# EAGLE design track-hold-sampler (EAGLE 9.5.0)
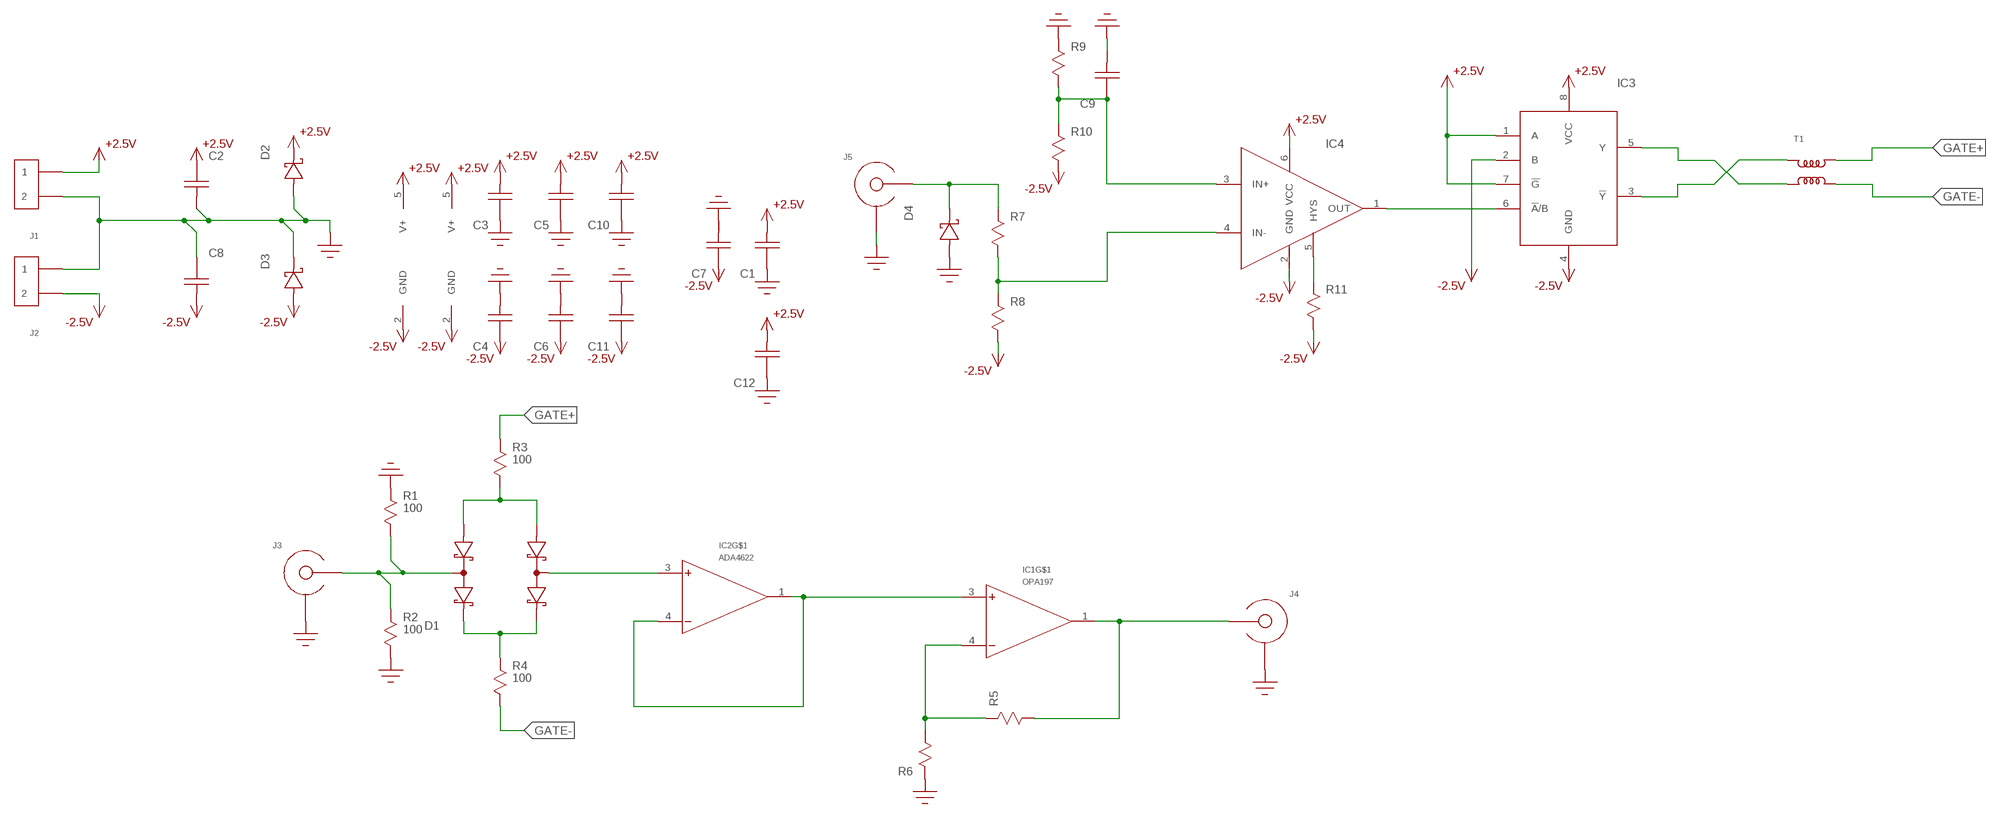
[diagram p0: schematic, sheet 1]

## Parts
C1  C0603  [C0603]
C2  C1206  [1206]
C3  C  [C0402]
C4  C  [C0402]
C5  C  [C0402]
C6  C  [C0402]
C7  C0603  [C0603]
C8  C1206  [1206]
C9  C  [C0402]
C10  C  [C0402]
C11  C  [C0402]
C12  C0603  [C0603]
D1  SMS3923-081  [SC-88]
D2  SCHOTTKYSOT-23  [SOT-23]
D3  SCHOTTKYSOT-23  [SOT-23]
D4  SCHOTTKYSOT-23  [SOT-23]
IC1  OPA197  OPA197TSOT  [TSOT-23]
IC2  ADA4622  [SOT23-5]
IC3  74LVC2G157  [SSOP8]
IC4  ADCMP601  [SC70-6]
J1  HEADER_2PIN  [HEADER_2PIN]
J2  HEADER_2PIN  [HEADER_2PIN]
J3  SMA-EDGE-LAUNCH4020N5  [SMA_EDGE_LAUNCH_4L_4020_N5]
J4  SMA-EDGE-LAUNCH4020N5  [SMA_EDGE_LAUNCH_4L_4020_N5]
J5  SMA-EDGE-LAUNCH4020N5  [SMA_EDGE_LAUNCH_4L_4020_N5]
R1  100  R0402  [0402]
R2  100  R0402  [0402]
R3  100  R0402  [0402]
R4  100  R0402  [0402]
R5  R0603  [R0603]
R6  R0603  [R0603]
R7  R0603  [R0603]
R8  R0603  [R0603]
R9  R0603  [R0603]
R10  R0603  [R0603]
R11  R0603  [R0603]
T1  MABA007159  [MABAES0061]

## Nets
+2.5V: C1.P$1 C2.P$2 C3.1 C5.1 C10.1 C12.P$1 D2.3(CATHODE) IC1.5(V+) IC2.5(V+) IC3.1(A) IC3.7(!G!) IC3.8(VCC) IC4.6(VCC) J1.1
-2.5V: C4.2 C6.2 C7.P$2 C8.P$1 C11.2 D3.1(ANODE) IC1.2(GND) IC2.2(GND) IC3.2(B) IC3.4(GND) IC4.2(GND) J2.2 R8.P$2 R10.P$2 R11.P$2
GATE+: R3.1 T1.1
GATE-: R4.2 T1.3
GND: C1.P$2 C2.P$1 C3.2 C4.1 C5.2 C6.1 C7.P$1 C8.P$2 C9.1 C10.2 C11.1 C12.P$2 D2.1(ANODE) D3.3(CATHODE) D4.1(ANODE) J1.2 J2.1 J3.BOTTOM_GND(SHIELD) J3.GND@1(SHIELD) J3.GND@2(SHIELD) J3.GND@3(SHIELD) J3.GND@4(SHIELD) J3.GND@5(SHIELD) J3.GND@6(SHIELD) J3.GND@7(SHIELD) J3.GND@8(SHIELD) J3.GND@9(SHIELD) J3.GND@10(SHIELD) J3.GND@14(SHIELD) J3.GND@15(SHIELD) J3.GND@16(SHIELD) J3.GND@17(SHIELD) J3.GND_PAD1(SHIELD) J3.GND_PAD2(SHIELD) J3.P$1(SHIELD) J3.P$2(SHIELD) J3.P$3(SHIELD) J3.P$4(SHIELD) J3.P$5(SHIELD) J4.BOTTOM_GND(SHIELD) J4.GND@1(SHIELD) J4.GND@2(SHIELD) J4.GND@3(SHIELD) J4.GND@4(SHIELD) J4.GND@5(SHIELD) J4.GND@6(SHIELD) J4.GND@7(SHIELD) J4.GND@8(SHIELD) J4.GND@9(SHIELD) J4.GND@10(SHIELD) J4.GND@14(SHIELD) J4.GND@15(SHIELD) J4.GND@16(SHIELD) J4.GND@17(SHIELD) J4.GND_PAD1(SHIELD) J4.GND_PAD2(SHIELD) J4.P$1(SHIELD) J4.P$2(SHIELD) J4.P$3(SHIELD) J4.P$4(SHIELD) J4.P$5(SHIELD) J5.BOTTOM_GND(SHIELD) J5.GND@1(SHIELD) J5.GND@2(SHIELD) J5.GND@3(SHIELD) J5.GND@4(SHIELD) J5.GND@5(SHIELD) J5.GND@6(SHIELD) J5.GND@7(SHIELD) J5.GND@8(SHIELD) J5.GND@9(SHIELD) J5.GND@10(SHIELD) J5.GND@14(SHIELD) J5.GND@15(SHIELD) J5.GND@16(SHIELD) J5.GND@17(SHIELD) J5.GND_PAD1(SHIELD) J5.GND_PAD2(SHIELD) J5.P$1(SHIELD) J5.P$2(SHIELD) J5.P$3(SHIELD) J5.P$4(SHIELD) J5.P$5(SHIELD) R1.1 R2.2 R6.P$1 R9.P$1
N$1: D1.2(COMMON0) J3.CENTER@1(CENTER) J3.CENTER@2(CENTER) R1.2 R2.1
N$2: D1.1(ANODE0) D1.6(ANODE1) R3.2
N$3: IC1.3(+) IC2.1(OUT) IC2.4(-)
N$4: IC1.4(-) R5.P$1 R6.P$2
N$5: IC1.1(OUT) J4.CENTER@1(CENTER) J4.CENTER@2(CENTER) R5.P$2
N$6: D1.5(COMMON1) IC2.3(+)
N$7: D1.3(CATHODE0) D1.4(CATHODE1) R4.1
N$8: IC3.6(!A!/B) IC4.1(OUT)
N$9: D4.3(CATHODE) J5.CENTER@1(CENTER) J5.CENTER@2(CENTER) R7.P$1
N$10: IC4.4(IN-) R7.P$2 R8.P$1
N$11: IC4.5(HYS) R11.P$1
N$12: C9.2 IC4.3(IN+) R9.P$2 R10.P$1
N$13: IC3.5(Y) T1.4
N$14: IC3.3(!Y!) T1.5

## Library data of the parts
C1-C12 = yapo:C
D1 = yapo:SMS3923-081
D2-D4 = yapo:SCHOTTKY
IC1 = yapo:OPA197
IC2 = yapo:ADA4622
IC3 = yapo:74LVC2G157
IC4 = yapo:ADCMP601
J1 J2 = yapo:HEADER_2PIN
J3-J5 = sma-temp:SMA-EDGE-LAUNCH
R1-R11 = yapo:R
T1 = yapo:MABA007159

## Board
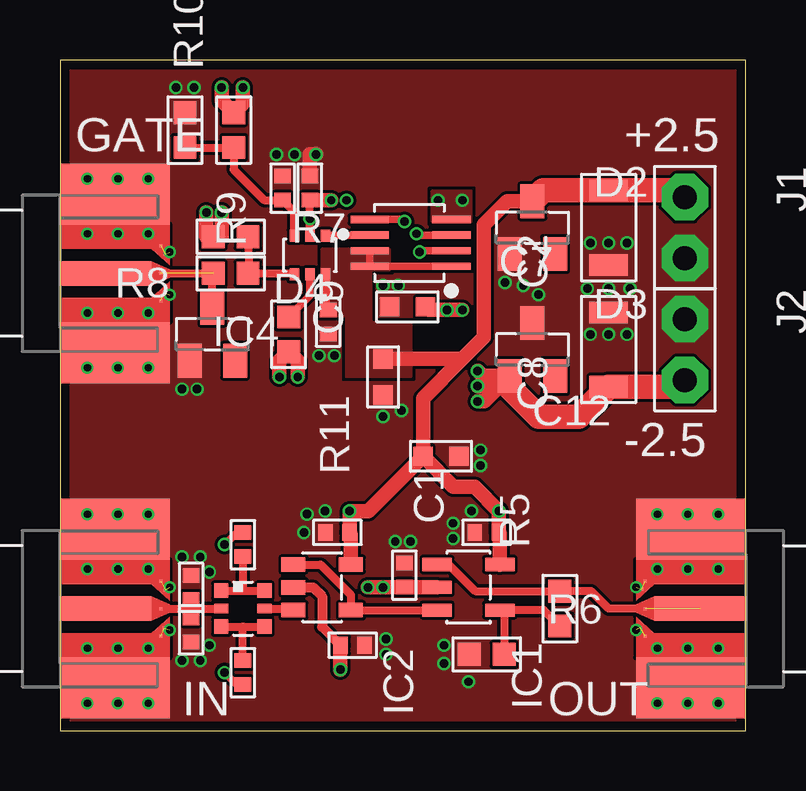
[diagram p1: board, top side]
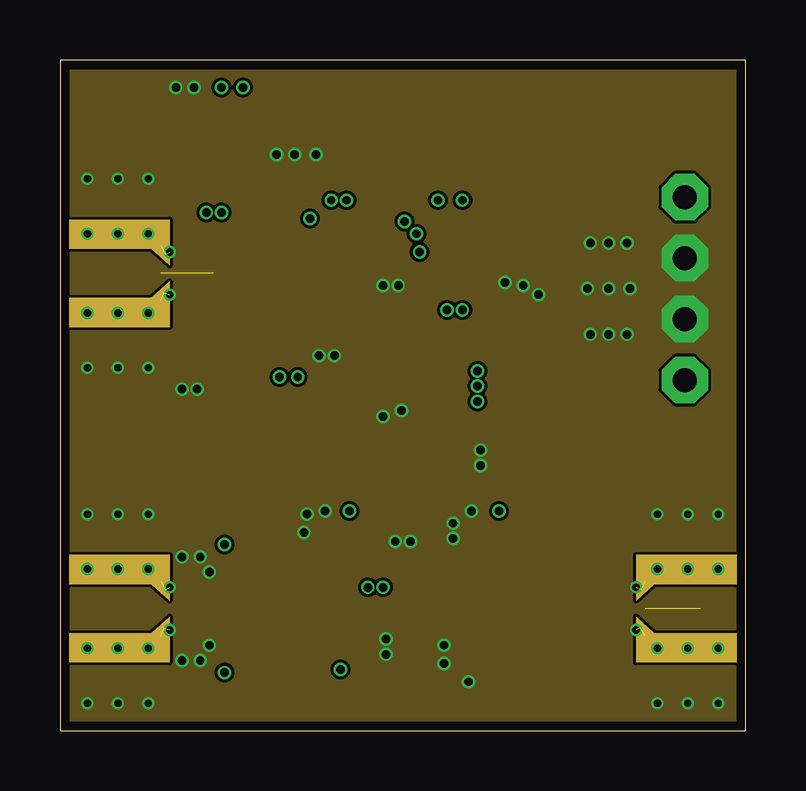
[diagram p2: board, inner layer Route2]
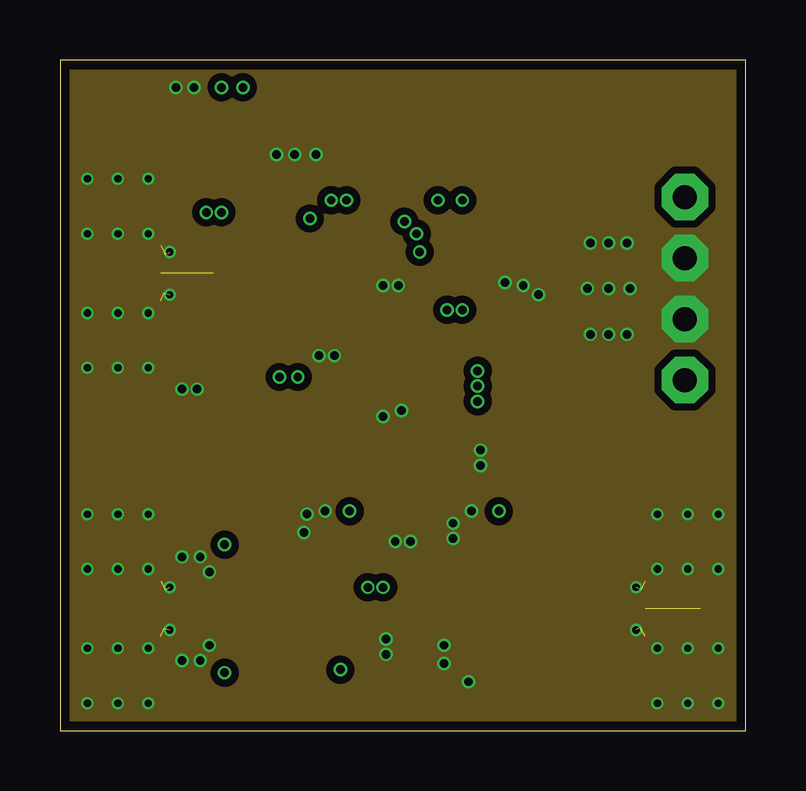
[diagram p3: board, inner layer Route15]
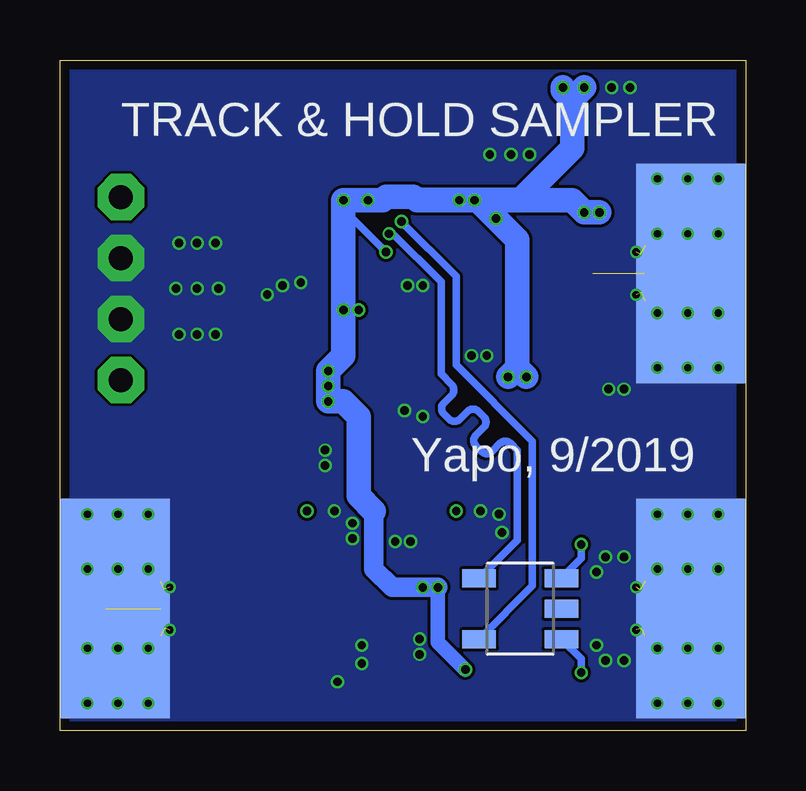
[diagram p4: board, bottom side, seen from below]

Size 28.57 x 27.94 mm. Coordinates in mm from the lower left corner, seen from the top.
Outline: 0,0 28.57,0 28.57,27.94 0,27.94 0,0
Copper layers (1*2*15*16): Top 0.035559375mm / dielectric 0.17018125mm / Route2 0.01778125mm / dielectric 47mil / Route15 0.01778125mm / dielectric 0.17018125mm / Bottom 0.035559375mm
Design rules "oshpark-4layer *": minimum track width 5mil, minimum drill 10mil, track to track 5mil, track to pad 5mil, pad to pad 5mil, via to via 5mil, smd to smd 5mil, copper to edge 15mil, drill to drill 6mil, minimum pad ring 4mil, minimum via ring 4mil, stop-mask expansion 2.5mil, vias tented up to drill 20mil, thermal gap 10mil

### Footprints (pad centres in the part's own frame; a part is rotated, then mirrored left to right if it is on the bottom)
C0603 = smd 0.8 x 0.8: P$1 -0.75,0; P$2 0.75,0
1206 = smd 0.9 x 1.6: P$1 -1.55,0; P$2 1.55,0
C0402 = smd 0.6 x 0.7: 1 -0.5,0; 2 0.5,0
SC-88 = smd 0.6 x 0.6: 1 -0.9,0.75; 3 -0.9,-0.75; 4 0.9,-0.75; 6 0.9,0.75 | smd 0.6 x 0.4: 2 -0.9,0; 5 0.9,0
SOT-23 = smd 1 x 1.4: 1 -0.95,-1.1; 2 0.95,-1.1; 3 0,1.1
TSOT-23 = smd 0.55 x 1.22: 1 -0.95,-1.31; 2 0,-1.31; 3 0.95,-1.31; 4 0.95,1.31; 5 -0.95,1.31
SOT23-5 = smd 0.6 x 1: 1 -0.95,-1.2; 2 0,-1.2; 3 0.95,-1.2; 4 0.95,1.2; 5 -0.95,1.2
SSOP8 = smd 0.3 x 1.6: 1 -0.975,-1.7; 2 -0.325,-1.7; 3 0.325,-1.7; 4 0.975,-1.7; 5 0.975,1.7; 6 0.325,1.7; 7 -0.325,1.7; 8 -0.975,1.7
SC70-6 = smd 0.4 x 0.5: 1 -0.65,-0.8; 2 0,-0.8; 3 0.65,-0.8; 4 0.65,0.8; 5 0,0.8; 6 -0.65,0.8
HEADER_2PIN = drill 1 pad 1.93 octagon: 1 -1.27,0; 2 1.27,0
SMA_EDGE_LAUNCH_4L_4020_N5 = smd 4.572 x 9.144 bottom: BOTTOM_GND 2.286,0 | smd 3.81 x 1.016: CENTER@1 1.905,0 | smd 0.127 x 0.127: CENTER@2 4.191,0; P$1 4.191,1.143; P$2 4.191,-1.143; P$3 4.191,1.143; P$4 4.394,0.787; P$5 4.343,-0.813 | drill 0.3: GND@1 1.143,3.937; GND@2 3.683,3.937; GND@3 1.143,1.651; GND@4 3.683,1.651; GND@5 1.143,-1.651; GND@6 3.683,-1.651; GND@7 1.143,-3.937; GND@8 3.683,-3.937; GND@9 4.572,0.889; GND@10 4.572,-0.889; GND@14 2.413,3.937; GND@15 2.413,-3.937; GND@16 2.413,-1.651; GND@17 2.413,1.651 | smd 4.572 x 2.54: GND_PAD1 2.286,3.302; GND_PAD2 2.286,-3.302
0402 = smd 0.6 x 0.7: 1 -0.5,0; 2 0.5,0
R0603 = smd 0.95 x 0.95: P$1 -0.725,0; P$2 0.725,0
MABAES0061 = smd 0.76 x 1.4: 1 1.27,-1.715; 2 0,-1.715; 3 -1.27,-1.715; 4 -1.27,1.715; 5 1.27,1.715

### Placement (x,y rotation side)
C1  13.46,14.73 270 top
C2  22.86,20.95 90 top
C3  11.56,8.26 180 top
C4  12.19,3.56 180 top
C5  17.78,8.26 180 top
C6  14.35,6.48 270 top
C7  14.48,17.65 0 top
C8  22.86,15.88 90 top
C9  9.27,22.61 270 top
C10  11.18,17.02 270 top
C11  10.41,22.61 270 top
C12  15.88,11.43 0 top
D1  7.62,5.08 0 top
D2  19.68,20.95 0 top
D3  19.68,15.88 0 top
D4  6.35,16.51 0 top
IC1  17.02,5.97 270 top
IC2  10.92,5.97 270 top
IC3  14.61,20.32 90 top
IC4  10.41,19.81 180 top
J1  26.04,20.95 270 top
J2  26.04,15.88 270 top
J3  0,5.08 0 top
J4  28.57,5.08 180 top
J5  0,19.05 0 top
R1  5.46,4.19 90 top
R2  5.46,5.97 90 top
R3  7.62,7.75 270 top
R4  7.62,2.41 270 top
R5  20.83,5.08 90 top
R6  17.78,3.17 0 top
R7  7.11,19.05 0 top
R8  7.11,20.57 180 top
R9  5.21,25.02 270 top
R10  7.24,25.02 90 top
R11  9.53,16.51 270 top
T1  9.4,5.08 90 bottom

### Tracks (layer width: path | path; a pad name or v marks a point on that pad's centre or on a via)
+2.5V  (via drill 0.35)
  Top 0.305: IC3.7 IC3.8 IC3.1 | 11.05,19 IC4.6
  Top 0.34: C3.1 12.12,8.19 | IC4.6 11.06,17.63 C10.1
  Top 0.61: 12.12,8.19 IC2.5 | IC1.5 18.33,8.21 C5.1 v18.29,9.14 17.27,10.16 16.39,10.16 C12.P$1 | C3.1 v12.06,9.14 12.84,9.14 C12.P$1 | D2.3 18.63,22.05 17.65,21.08 17.65,16.38 16.75,15.48 | 16.75,15.48 C1.P$1 | C12.P$1 15.12,13.86 16.75,15.48
  Top 1.016: J1.1 25.75,22.5 C2.P$2 20.14,22.5 D2.3
  pour Top (no thermals): 10.92,20.07 13.72,20.07 13.72,19.18 12.95,19.18 12.95,17.02 14.61,17.02 14.61,14.73 11.94,14.73 11.94,17.27 10.92,17.27
-2.5V  (via drill 0.35)
  Top 0.305: v10.41,21.34 IC4.2 | IC3.2 15.04,20 v14.99,19.94
  Top 0.34: IC4.2 C11.2
  Top 0.406: IC2.2 10.54,5.97 10.92,5.59 10.92,4.32 C4.2
  Top 0.61: C6.2 IC1.2 v12.83,5.97 | C6.2 | v13.46,5.97 C6.2 | C11.2 v11.29,22.11 v11.3,22.1 | v9.14,14.73 9.14,15.4 R11.P$2 9.91,15.4 v9.91,14.73 | v6.73,26.8 6.73,26.25 R10.P$2 7.62,26.12 v7.62,26.8 | v6.1,21.59 6.1,20.57 R8.P$2 6.73,20.57 v6.73,21.59 | D3.1 17.61,14.78 v17.4,14.99 | D3.1 18.31,14.35 v17.4,14.35 | D3.1 17.68,13.72 v17.4,13.72 | C7.P$2 15.36,17.53 v16.13,17.53 v16.76,17.53 | v11.68,2.54 11.68,3.55 C4.2
  Top 1.016: J2.2 25.75,14.32 C8.P$1 21.62,13.08 19.94,13.08 18.73,14.29 D3.1
  Bottom 0.305: v14.99,19.94 16.76,21.72 v16.76,22.1
  Bottom 0.61: v12.83,5.97 12.83,3.68 v11.68,2.54
  Bottom 0.813: 15.49,9.14 15.49,6.73 14.73,5.97 v13.46,5.97 v12.83,5.97
  Bottom 1.016: 13.72,22.12 13.85,22.25 14.98,22.25 15.13,22.1 v15.75,22.1 v16.76,22.1 v16.76,17.53 16.76,15.62 v17.4,14.99 v17.4,14.35 v17.4,13.72 16.76,13.72 16.13,13.08 16.13,9.78 15.49,9.14 | 13.72,22.12 13.7,22.1 v11.94,22.1 v11.3,22.1 | v11.3,22.1 11.18,22.1 v10.41,21.34 9.53,20.45 9.53,15.11 | 9.53,15.11 v9.14,14.73 | 9.53,15.11 v9.91,14.73 | v6.1,21.59 v6.73,21.59 7.24,22.1 v11.3,22.1 | 13.72,22.12 9.38,22.12 7.24,24.26 7.24,26.29 | v6.73,26.8 7.24,26.29 | 7.24,26.29 7.62,26.67 v7.62,26.8
  pour Top (no thermals): 15.49,21.21 17.14,21.21 17.14,22.48 15.49,22.48
GATE+  (via drill 0.35)
  Top 0.305: v6.86,7.75 7.36,8.25 R3.1
  Bottom 0.305: T1.1 6.86,7.17 v6.86,7.75
GATE-  (via drill 0.35)
  Top 0.305: v6.86,2.41 7.36,1.91 R4.2
  Bottom 0.305: T1.3 6.86,2.98 v6.86,2.41
GND  (via drill 0.35)  (12 unrouted)
  Top 0.61: C11.1 10.41,24 v10.67,24
  other vias: 13.59,3.17 13.59,3.81 10.29,9.02 10.16,8.26 5.08,7.24 5.84,7.24 5.08,2.92 5.84,2.92 6.22,3.56 6.22,6.6 13.97,7.87 14.61,7.87 16.38,8.64 16.38,8 11.05,9.14 17.14,9.14 16,3.56 16,2.79 17.02,2.03 4.83,26.8 5.59,26.8 5.08,14.22 5.71,14.22 10.79,15.62 11.43,15.62 9.78,24 9.02,24 18.54,18.67 22.86,18.41 19.3,18.54 19.94,18.16 21.97,18.41 23.75,18.41 22.86,20.32 22.1,20.32 23.62,20.32 22.86,16.51 22.1,16.51 23.62,16.51 14.22,13.34 13.46,13.08 13.46,18.54 14.1,18.54 17.53,11.68 17.53,11.05
  pour Bottom (rank 2, no thermals): 0,0 0,27.94 28.57,27.94 28.57,0
  pour Top (rank 2, no thermals): 0,0 0,27.94 28.57,27.94 28.57,0
  pour Route2 (no thermals): 0,0 0,27.94 28.57,27.94 28.57,0
  pour Route15 (isolate 0.305, rank 2, no thermals): 0,0 28.57,0 28.57,27.94 0,27.94
N$1
  Top 0.34: J3.CENTER@1 J3.CENTER@2 5.46,5.08 | 5.46,5.08 5.71,5.08 | 5.71,5.08 D1.2 | 5.71,5.08 5.46,4.83 R1.2 5.46,5.08 | R2.1 5.46,5.08
N$2
  Top 0.34: D1.1 7.62,5.83 | 7.62,5.83 D1.6 | R3.2 7.62,5.83
N$3
  Top 0.34: IC2.1 10.86,6.92 12.12,5.65 IC2.4 IC1.3
N$4
  Top 0.34: R6.P$2 18.5,4.84 IC1.4 20.16,5.02 R5.P$1
N$5  (1 unrouted)
  Top 0.34: IC1.1 16.2,6.92 17.31,5.8 R5.P$2 22.14,5.8 22.86,5.08 J4.CENTER@1
N$6
  Top 0.34: D1.5 9.66,5.08 IC2.3
N$7
  Top 0.34: D1.3 7.62,4.33 | 7.62,4.33 D1.4 | R4.1 7.62,4.33
N$8
  Top 0.305: IC3.6 11.1,20.64 IC4.1
N$9  (1 unrouted)
  Top 0.34: J5.CENTER@1 R7.P$1 6.35,19.01 D4.3
N$10
  Top 0.34: IC4.4 9.73,19.05 R7.P$2 7.87,19.09 R8.P$1
N$11
  Top 0.305: IC4.5 10.41,18.12 R11.P$1
N$12
  Top 0.34: IC4.3 9.76,21.61 C9.2 9.26,22.1 8.51,22.1 7.24,23.37 R10.P$1 R9.P$2
N$13  (via drill 0.35)
  Top 0.305: IC3.5 14.27,21.3 v14.35,21.21
  Bottom 0.305: v14.35,21.21 12.06,18.92 12.06,15.24 8.89,12.06 8.89,6.03 T1.4
N$14  (via drill 0.35)
  Top 0.305: IC3.3 14.91,20.64 v14.86,20.7
  Bottom 0.305: T1.5 9.53,7.94 9.53,11.68 9.8,11.96 arc-90 10.24,11.96 10.57,11.63 arc90 11.01,11.63 11.24,11.86 arc90 11.24,12.3 10.91,12.63 arc-90 10.91,13.07 11.14,13.3 arc-90 11.59,13.3 11.91,12.97 arc90 12.36,12.97 12.59,13.2 arc90 12.59,13.64 12.26,13.97 arc-90 12.26,14.41 12.7,14.86 12.7,18.69 14.71,20.7 v14.86,20.7

### Text on the board
tPlace: GATE | +2.5 | -2.5 | IN | OUT
bPlace: TRACK & HOLD SAMPLER | Yapo, 9/2019